# EAGLE board pdp8l (EAGLE 6.6.0), part 1 of 10
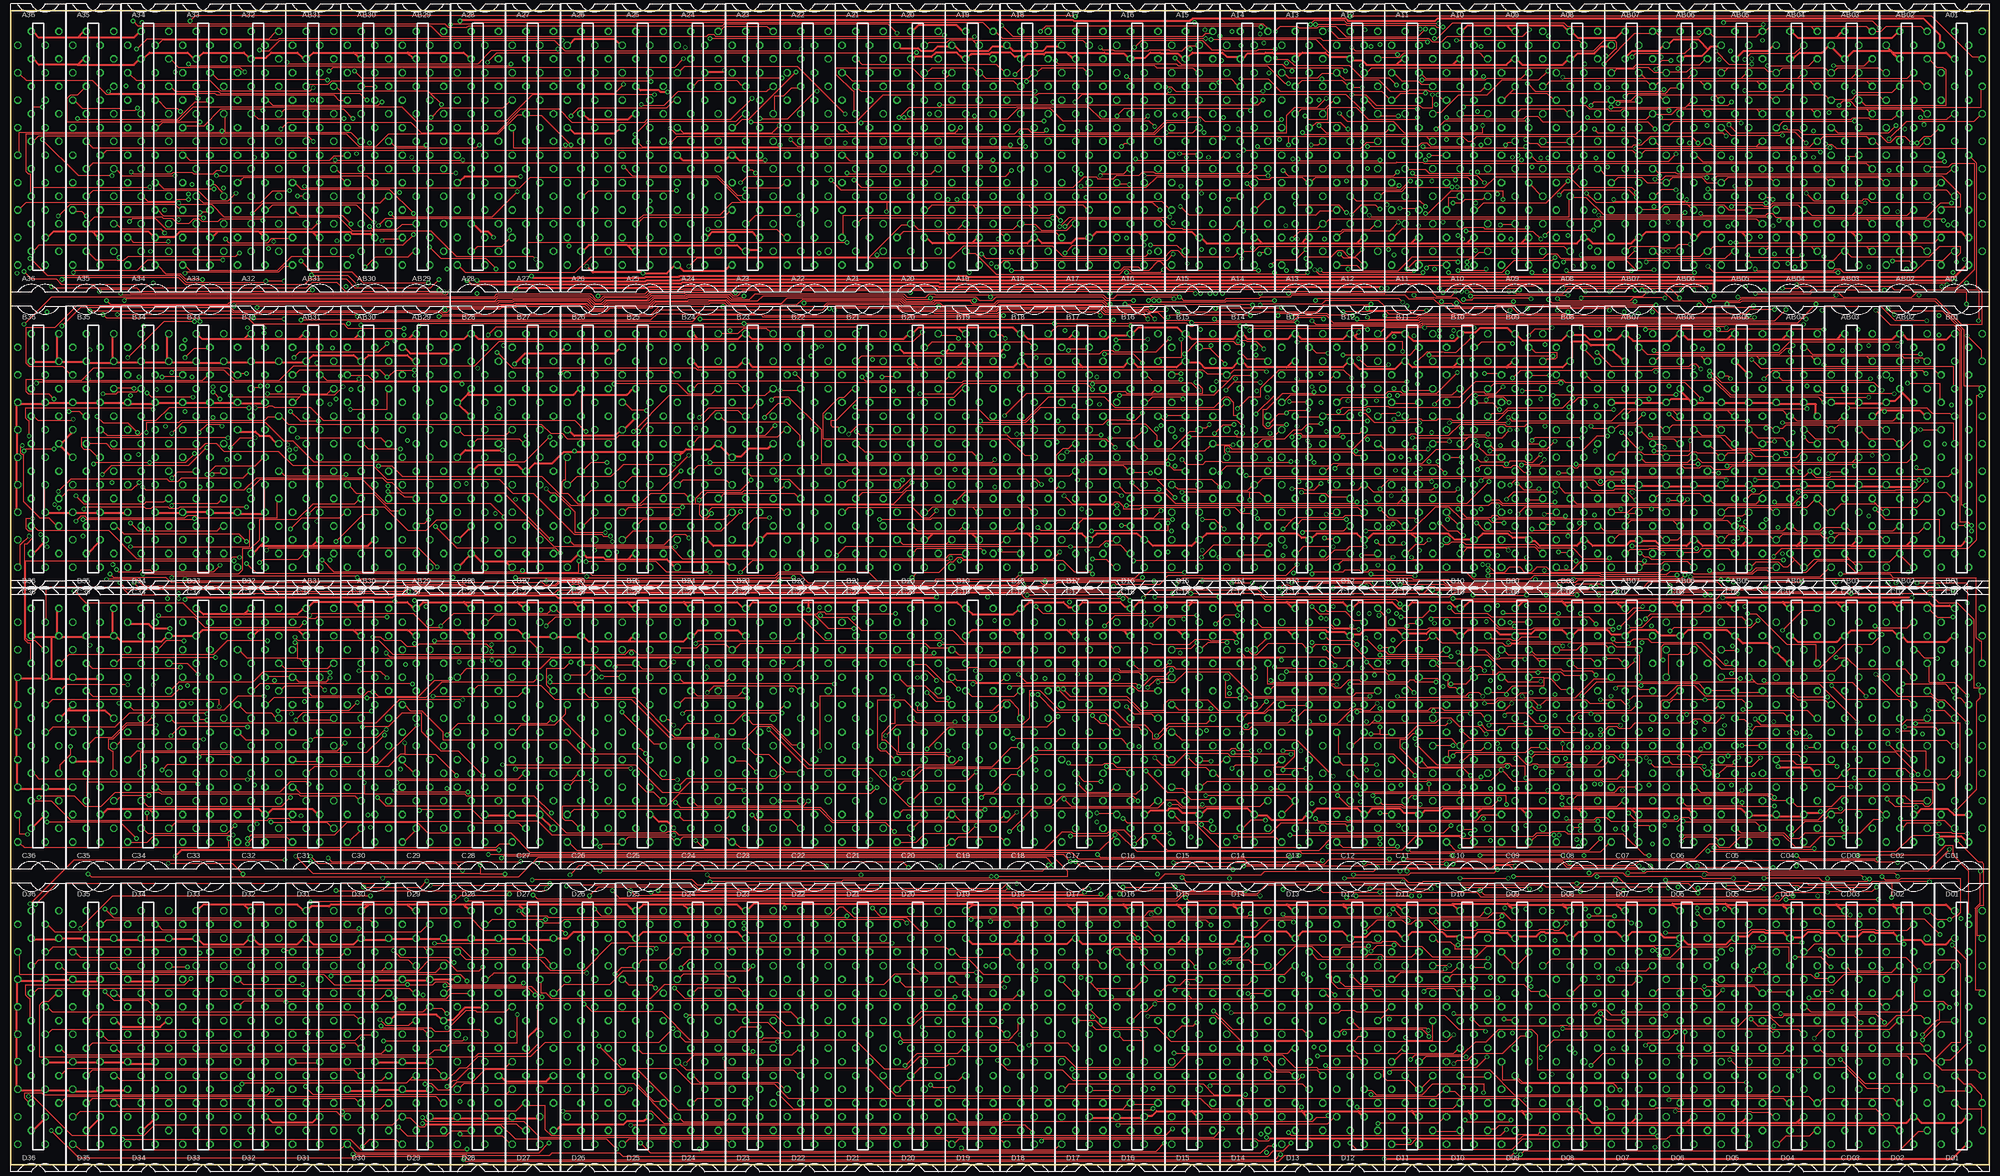
[diagram p23: board, top side]
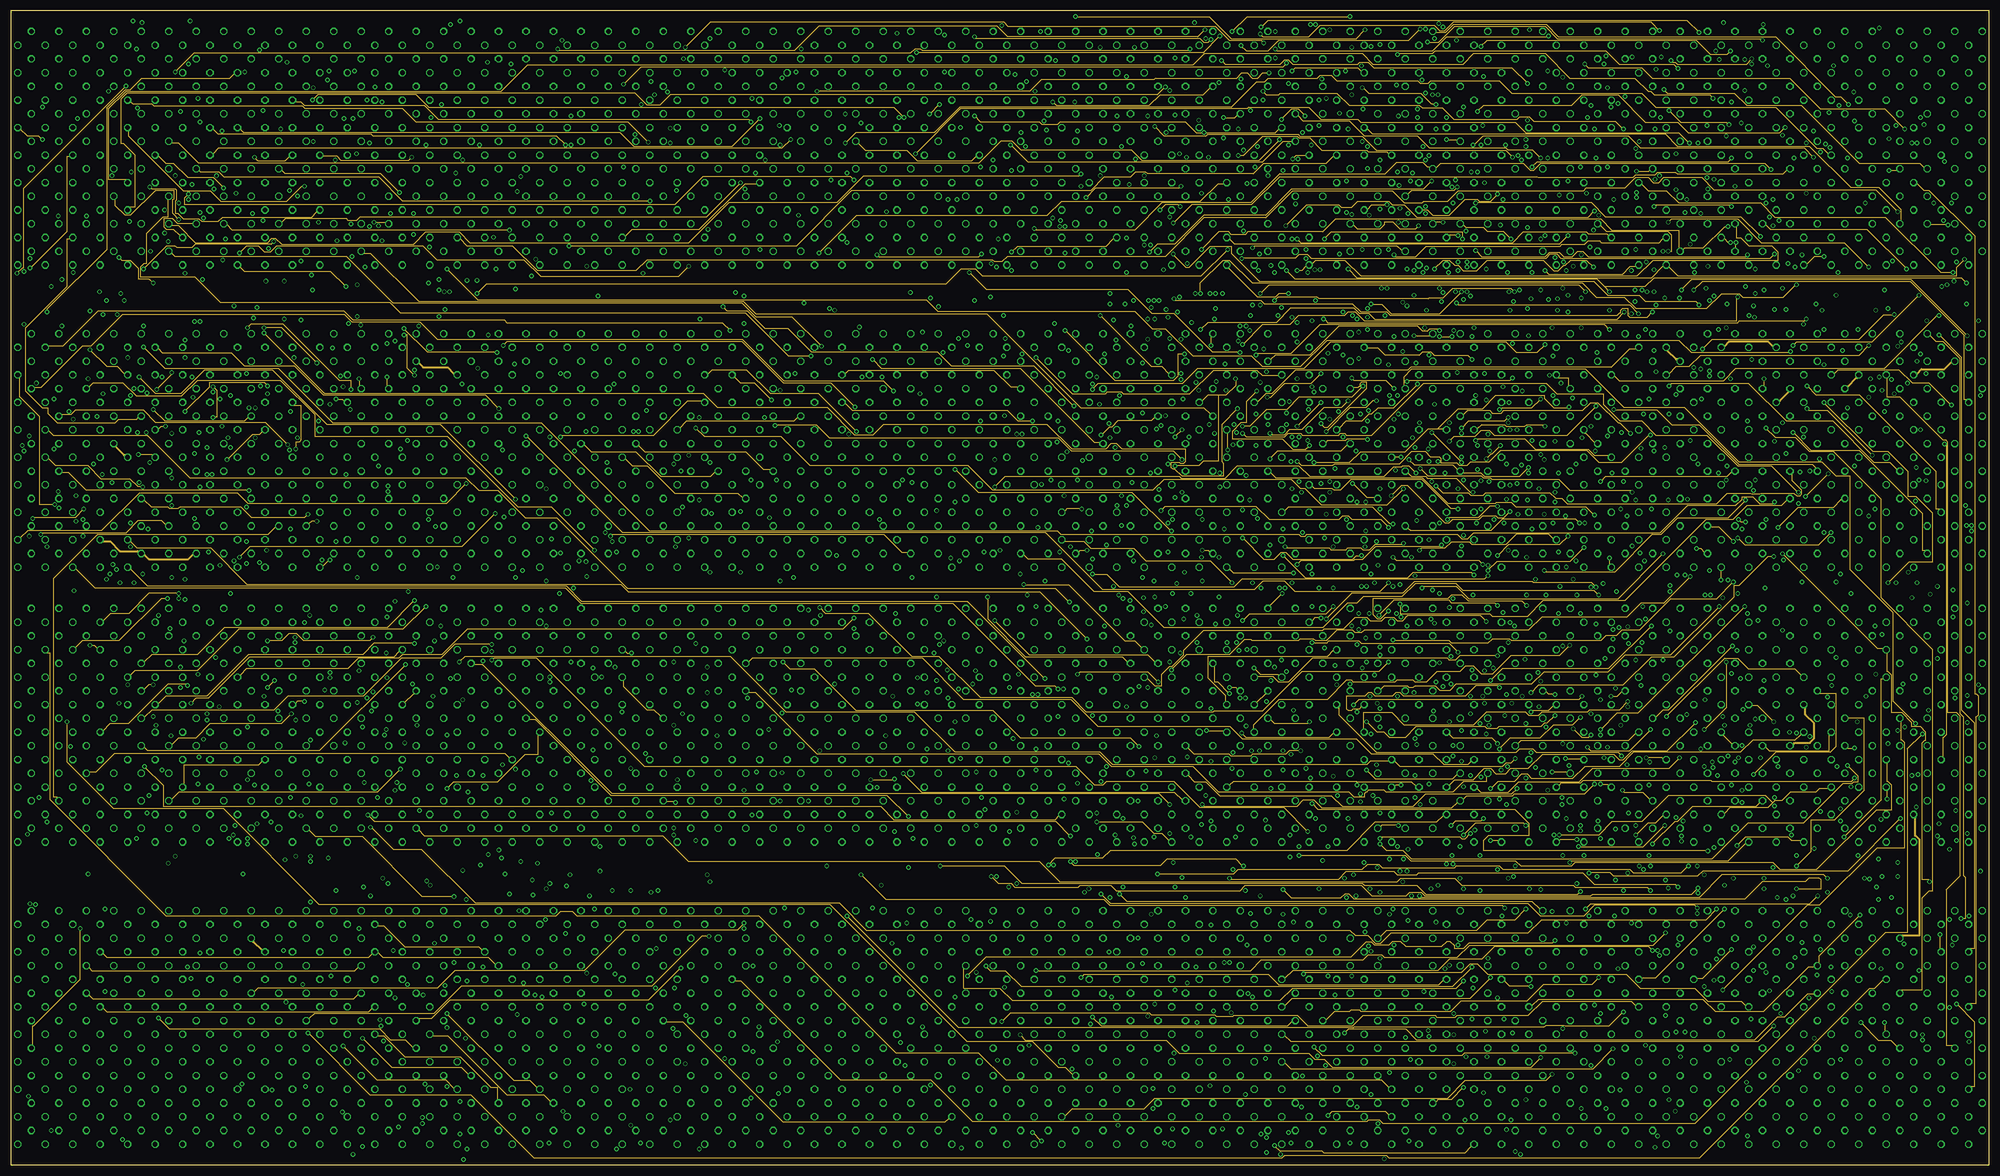
[diagram p24: board, inner layer Route2]
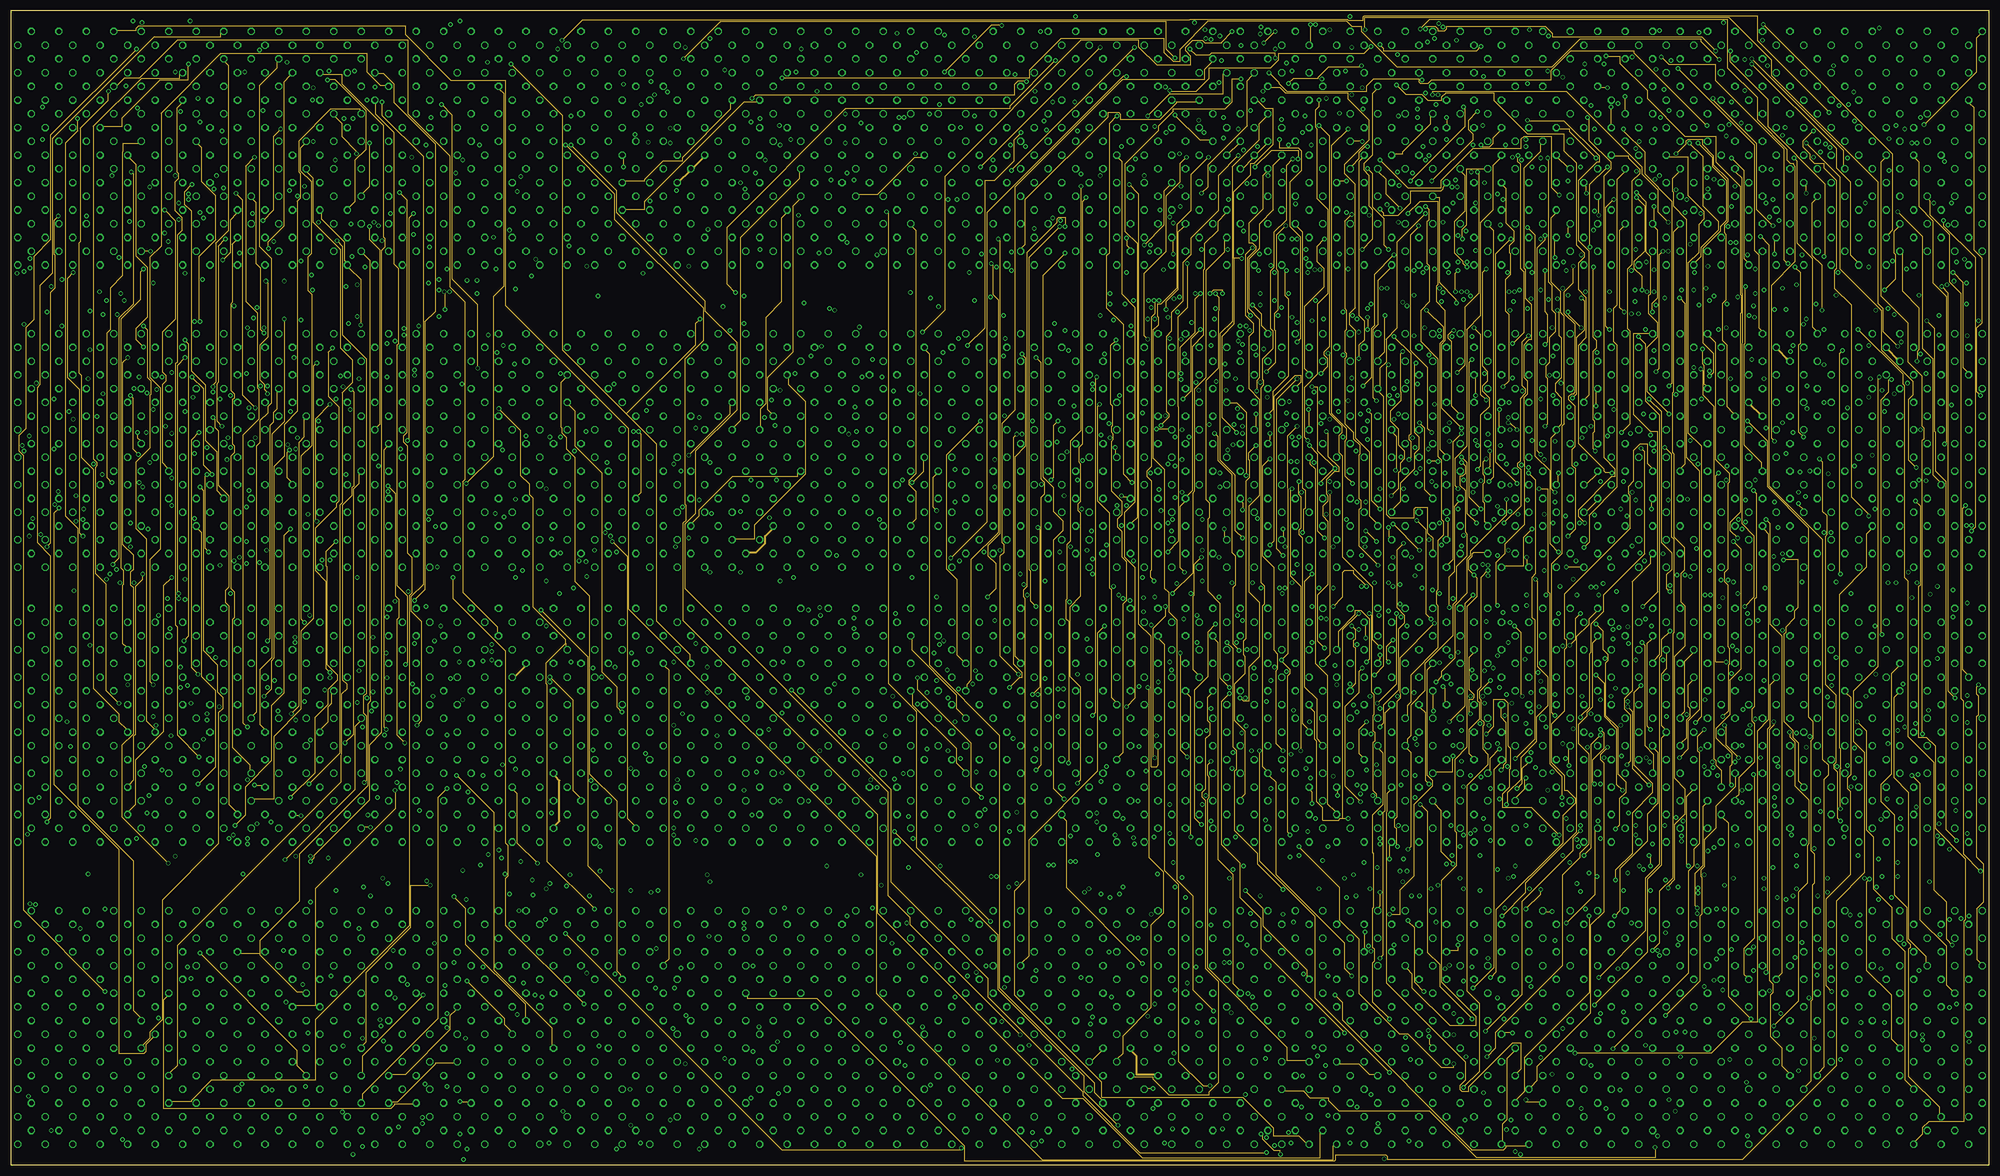
[diagram p25: board, inner layer Route15]
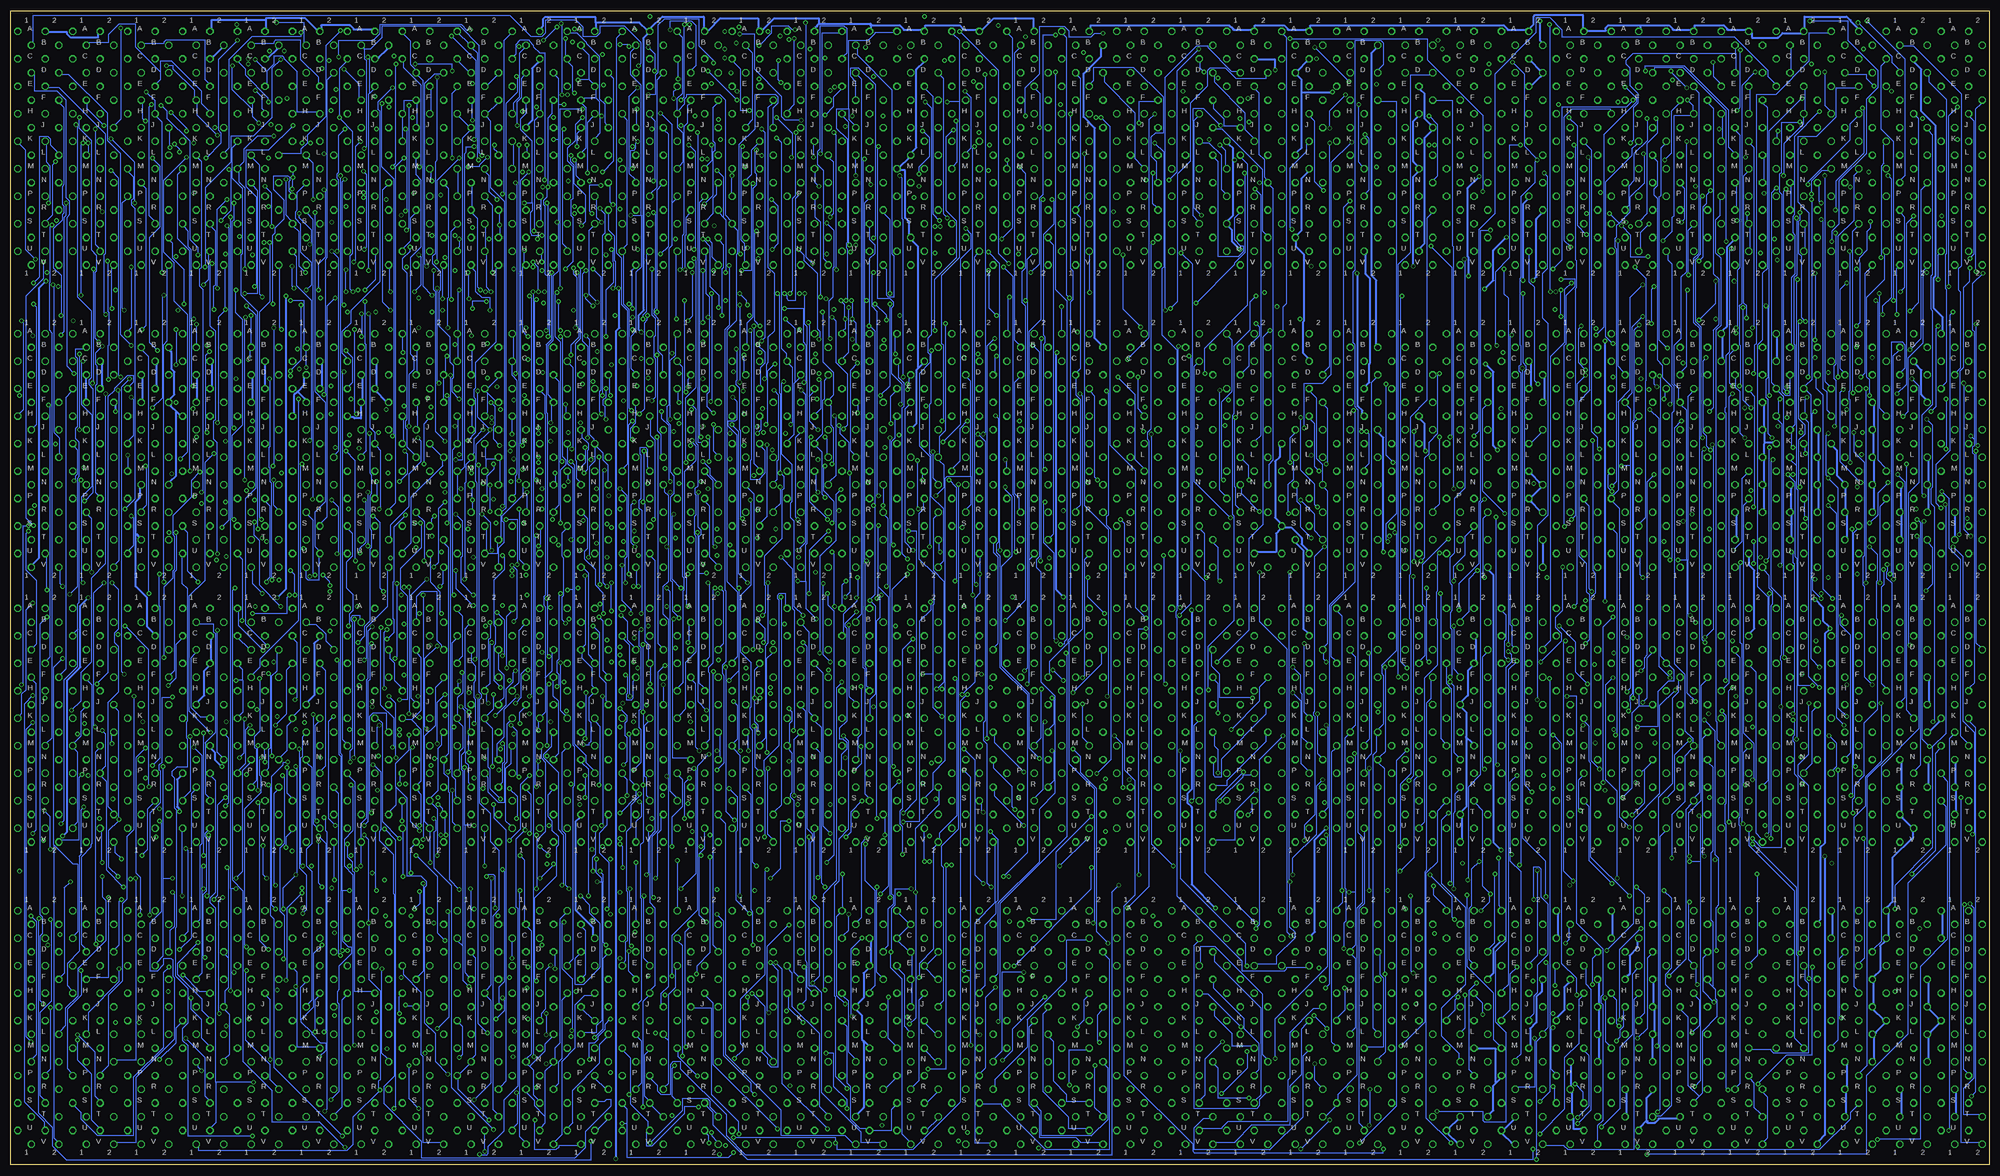
[diagram p26: board, bottom side, seen from below]

Size 457.2 x 266.7 mm. Coordinates in mm from the lower left corner, seen from the top.
Outline: 0,0 457.2,0 457.2,266.7 0,266.7 0,0
Copper layers (1*2*15*16): Top 0.035mm / dielectric 1.5mm / Route2 0.035mm / dielectric 0.15mm / Route15 0.035mm / dielectric 0.2mm / Bottom 0.035mm
Design rules "8mils": minimum track width 8mil, minimum drill 24mil, track to track 8mil, track to pad 8mil, pad to pad 8mil, via to via 8mil, smd to smd 8mil, copper to edge 25mil, drill to drill 8mil, minimum pad ring 10mil, minimum via ring 8mil, stop-mask expansion 0mil, vias tented up to drill 0mil, thermal gap 10mil
Net classes: 1 Supply: width 0.508 mm

## Footprints (pad centres in the part's own frame; a part is rotated, then mirrored left to right if it is on the bottom)
H807 = drill 1.092 octagon: A1 4.763,28.575; A2 -1.587,28.575; B1 1.587,25.4; B2 -4.763,25.4; C1 4.763,22.225; C2 -1.587,22.225; D1 1.587,19.05; D2 -4.763,19.05; E1 4.763,15.875; E2 -1.587,15.875; F1 1.587,12.7; F2 -4.763,12.7; H1 4.763,9.525; H2 -1.587,9.525; J1 1.587,6.35; J2 -4.763,6.35; K1 4.763,3.175; K2 -1.587,3.175; L1 1.587,0; L2 -4.763,0; M1 4.763,-3.175; M2 -1.587,-3.175; N1 1.587,-6.35; N2 -4.763,-6.35; P1 4.763,-9.525; P2 -1.587,-9.525; R1 1.587,-12.7; R2 -4.763,-12.7; S1 4.763,-15.875; S2 -1.587,-15.875; T1 1.587,-19.05; T2 -4.763,-19.05; U1 4.763,-22.225; U2 -1.587,-22.225; V1 1.587,-25.4; V2 -4.763,-25.4
H807-2 = drill 1.092 octagon: AA1 4.763,60.325; AA2 -1.587,60.325; AB1 1.587,57.15; AB2 -4.763,57.15; AC1 4.763,53.975; AC2 -1.587,53.975; AD1 1.587,50.8; AD2 -4.763,50.8; AE1 4.763,47.625; AE2 -1.587,47.625; AF1 1.587,44.45; AF2 -4.763,44.45; AH1 4.763,41.275; AH2 -1.587,41.275; AJ1 1.587,38.1; AJ2 -4.763,38.1; AK1 4.763,34.925; AK2 -1.587,34.925; AL1 1.587,31.75; AL2 -4.763,31.75; AM1 4.763,28.575; AM2 -1.587,28.575; AN1 1.587,25.4; AN2 -4.763,25.4; AP1 4.763,22.225; AP2 -1.587,22.225; AR1 1.587,19.05; AR2 -4.763,19.05; AS1 4.763,15.875; AS2 -1.587,15.875; AT1 1.587,12.7; AT2 -4.763,12.7; AU1 4.763,9.525; AU2 -1.587,9.525; AV1 1.587,6.35; AV2 -4.763,6.35; BA1 4.763,-9.525; BA2 -1.587,-9.525; BB1 1.587,-12.7; BB2 -4.763,-12.7; BC1 4.763,-15.875; BC2 -1.587,-15.875; BD1 1.587,-19.05; BD2 -4.763,-19.05; BE1 4.763,-22.225; BE2 -1.587,-22.225; BF1 1.587,-25.4; BF2 -4.763,-25.4; BH1 4.763,-28.575; BH2 -1.587,-28.575; BJ1 1.587,-31.75; BJ2 -4.763,-31.75; BK1 4.763,-34.925; BK2 -1.587,-34.925; BL1 1.587,-38.1; BL2 -4.763,-38.1; BM1 4.763,-41.275; BM2 -1.587,-41.275; BN1 1.587,-44.45; BN2 -4.763,-44.45; BP1 4.763,-47.625; BP2 -1.587,-47.625; BR1 1.587,-50.8; BR2 -4.763,-50.8; BS1 4.763,-53.975; BS2 -1.587,-53.975; BT1 1.587,-57.15; BT2 -4.763,-57.15; BU1 4.763,-60.325; BU2 -1.587,-60.325; BV1 1.587,-63.5; BV2 -4.763,-63.5

## Placement (x,y rotation side)
A01  G921  [H807]  450.85,233.36 0 top
A08  M617  [H807]  361.95,233.36 0 top
A09  M617  [H807]  349.25,233.36 0 top
A10  M160  [H807]  336.55,233.36 0 top
A11  M115  [H807]  323.85,233.36 0 top
A12  M160  [H807]  311.15,233.36 0 top
A13  M160  [H807]  298.45,233.36 0 top
A14  M115  [H807]  285.75,233.36 0 top
A15  M162  [H807]  273.05,233.36 0 top
A16  M162  [H807]  260.35,233.36 0 top
A17  G020  [H807]  247.65,233.36 0 top
A18  G020  [H807]  234.95,233.36 0 top
A19  G020  [H807]  222.25,233.36 0 top
A20  G020  [H807]  209.55,233.36 0 top
A21  W025A  [H807]  196.85,233.36 0 top
A22  W025A  [H807]  184.15,233.36 0 top
A23  G228  [H807]  171.45,233.36 0 top
A24  G228  [H807]  158.75,233.36 0 top
A25  G624  [H807]  146.05,233.36 0 top
A26  G624  [H807]  133.35,233.36 0 top
A27  G826A  [H807]  120.65,233.36 0 top
A28  G785A  [H807]  107.95,233.36 0 top
A32  M516  [H807]  57.15,233.36 0 top
A33  M516  [H807]  44.45,233.36 0 top
A34  M111  [H807]  31.75,233.36 0 top
A35  M111  [H807]  19.05,233.36 0 top
A36  M703  [H807]  6.35,233.36 0 top
AB02  M220  [H807-2]  438.15,201.61 0 top
AB03  M220  [H807-2]  425.45,201.61 0 top
AB04  M220  [H807-2]  412.75,201.61 0 top
AB05  M220  [H807-2]  400.05,201.61 0 top
AB06  M220  [H807-2]  387.35,201.61 0 top
AB07  M220  [H807-2]  374.65,201.61 0 top
AB29  M715  [H807-2]  95.25,201.61 0 top
AB30  M705  [H807-2]  82.55,201.61 0 top
AB31  M710  [H807-2]  69.85,201.61 0 top
B01  G921  [H807]  450.85,163.51 0 top
B08  M617  [H807]  361.95,163.51 0 top
B09  M617  [H807]  349.25,163.51 0 top
B10  M160  [H807]  336.55,163.51 0 top
B11  M216  [H807]  323.85,163.51 0 top
B12  M111  [H807]  311.15,163.51 0 top
B13  M113  [H807]  298.45,163.51 0 top
B14  M119  [H807]  285.75,163.51 0 top
B15  M119  [H807]  273.05,163.51 0 top
B16  M162  [H807]  260.35,163.51 0 top
B17  M162  [H807]  247.65,163.51 0 top
B18  G020  [H807]  234.95,163.51 0 top
B19  G020  [H807]  222.25,163.51 0 top
B20  G020  [H807]  209.55,163.51 0 top
B21  W025B  [H807]  196.85,163.51 0 top
B22  W025B  [H807]  184.15,163.51 0 top
B23  G228  [H807]  171.45,163.51 0 top
B24  G228  [H807]  158.75,163.51 0 top
B25  G624  [H807]  146.05,163.51 0 top
B26  G624  [H807]  133.35,163.51 0 top
B27  G826B  [H807]  120.65,163.51 0 top
B28  G785B  [H807]  107.95,163.51 0 top
B32  M906  [H807]  57.15,163.51 0 top
B33  M906  [H807]  44.45,163.51 0 top
B34  M903  [H807]  31.75,163.51 0 top
B35  M903  [H807]  19.05,163.51 0 top
B36  M903  [H807]  6.35,163.51 0 top
C01  G921  [H807]  450.85,100.01 0 top
C02  M113  [H807]  438.15,100.01 0 top
C04  M216  [H807]  412.75,100.01 0 top
C05  M113  [H807]  400.05,100.01 0 top
C06  M216  [H807]  387.35,100.01 0 top
C07  M111  [H807]  374.65,100.01 0 top
C08  M216  [H807]  361.95,100.01 0 top
C09  M115  [H807]  349.25,100.01 0 top
C10  M119  [H807]  336.55,100.01 0 top
C11  M117  [H807]  323.85,100.01 0 top
C12  M115  [H807]  311.15,100.01 0 top
C13  M117  [H807]  298.45,100.01 0 top
C14  M113  [H807]  285.75,100.01 0 top
C15  M113  [H807]  273.05,100.01 0 top
C16  M111  [H807]  260.35,100.01 0 top
C17  M360  [H807]  247.65,100.01 0 top
C18  G221  [H807]  234.95,100.01 0 top
C19  G221  [H807]  222.25,100.01 0 top
C20  G610A  [H807]  209.55,100.01 0 top
C21  H807  [H807]  196.85,100.01 0 top
C22  G610A  [H807]  184.15,100.01 0 top
C23  G221  [H807]  171.45,100.01 0 top
C24  G221  [H807]  158.75,100.01 0 top
C25  G228  [H807]  146.05,100.01 0 top
C26  M002  [H807]  133.35,100.01 0 top
C27  M623  [H807]  120.65,100.01 0 top
C28  M115  [H807]  107.95,100.01 0 top
C29  M660  [H807]  95.25,100.01 0 top
C30  M660  [H807]  82.55,100.01 0 top
C31  M707A  [H807]  69.85,100.01 0 top
C32  M706A  [H807]  57.15,100.01 0 top
C33  M452  [H807]  44.45,100.01 0 top
C34  M916  [H807]  31.75,100.01 0 top
C35  M903  [H807]  19.05,100.01 0 top
C36  M903  [H807]  6.35,100.01 0 top
CD03  M700  [H807-2]  425.45,68.26 0 top
D01  G921  [H807]  450.85,30.16 0 top
D02  M111  [H807]  438.15,30.16 0 top
D04  M115  [H807]  412.75,30.16 0 top
D05  M310  [H807]  400.05,30.16 0 top
D06  M310  [H807]  387.35,30.16 0 top
D07  M310  [H807]  374.65,30.16 0 top
D08  M310  [H807]  361.95,30.16 0 top
D09  M160  [H807]  349.25,30.16 0 top
D10  M216  [H807]  336.55,30.16 0 top
D11  M113  [H807]  323.85,30.16 0 top
D12  M113  [H807]  311.15,30.16 0 top
D13  M111  [H807]  298.45,30.16 0 top
D14  M310  [H807]  285.75,30.16 0 top
D15  M310  [H807]  273.05,30.16 0 top
D16  M216  [H807]  260.35,30.16 0 top
D17  M617  [H807]  247.65,30.16 0 top
D18  G221  [H807]  234.95,30.16 0 top
D19  G221  [H807]  222.25,30.16 0 top
D20  G611B  [H807]  209.55,30.16 0 top
D21  H807  [H807]  196.85,30.16 0 top
D22  G611B  [H807]  184.15,30.16 0 top
D23  G221  [H807]  171.45,30.16 0 top
D24  G221  [H807]  158.75,30.16 0 top
D25  G228  [H807]  146.05,30.16 0 top
D26  H807  [H807]  133.35,30.16 0 top
D27  M623  [H807]  120.65,30.16 0 top
D28  M623  [H807]  107.95,30.16 0 top
D29  M906  [H807]  95.25,30.16 0 top
D30  M906  [H807]  82.55,30.16 0 top
D31  M707B  [H807]  69.85,30.16 0 top
D32  M706B  [H807]  57.15,30.16 0 top
D33  W076  [H807]  44.45,30.16 0 top
D34  M903  [H807]  31.75,30.16 0 top
D35  M903  [H807]  19.05,30.16 0 top
D36  M903  [H807]  6.35,30.16 0 top
U$1  [CBLOCK]  0,0 0 top
U$2  [CBLOCK]  50.8,0 0 top
U$3  [CBLOCK]  101.6,0 0 top
U$4  [CBLOCK]  152.4,0 0 top
U$5  [CBLOCK]  203.2,0 0 top
U$6  [CBLOCK]  254,0 0 top
U$7  [CBLOCK]  304.8,0 0 top
U$8  [CBLOCK]  355.6,0 0 top
U$9  [CBLOCK]  406.4,0 0 top
U$10  [CBLOCK]  0,133.35 0 top
U$11  [CBLOCK]  50.8,133.35 0 top
U$12  [CBLOCK]  101.6,133.35 0 top
U$13  [CBLOCK]  152.4,133.35 0 top
U$14  [CBLOCK]  203.2,133.35 0 top
U$15  [CBLOCK]  254,133.35 0 top
U$16  [CBLOCK]  304.8,133.35 0 top
U$17  [CBLOCK]  355.6,133.35 0 top
U$18  [CBLOCK]  406.4,133.35 0 top

## Tracks (layer width: path | path; a pad name or v marks a point on that pad's centre or on a via)
3CYCLE  (via drill 0.61)
  Top 0.203: v201.17,64.62 158.7,64.62 157.48,65.84 v120.5,65.84
  Route2 0.203: v116.64,153.82 99.36,171.09 73.15,171.09 60.55,183.69 44.7,183.69 39.22,178.21 33.53,178.21 v29.67,182.07
  Bottom 0.203: v201.17,64.62 202.79,62.99 202.79,2.23 287.32,2.23 291.8,6.71 291.8,11.58 302.36,22.15 302.36,23.77 304.19,23.77 304.8,23.16 304.8,16.26 306.83,16.26 307.64,17.07 307.64,18.29 309.27,19.91 D12.P2 | v120.5,65.84 120.29,66.04 120.29,87.38 117.45,90.22 117.45,153.01 v116.64,153.82 | v29.67,182.07 28.65,183.08 28.65,206.04 27.43,207.26 A34.V2
!3CYCLE  (via drill 0.61)
  Top 0.203: v19.1,161.95 19.51,162.36 v32.11,162.36 40.44,162.36 v42.47,164.39
  Route15 0.203: v32.31,211.12 30.89,211.12 A34.U2
  Bottom 0.203: v19.1,161.95 19.1,105.05 17.88,103.83 C35.K2 | v42.47,164.39 42.47,166.01 B33.K2 | v32.31,211.12 32.11,210.92 32.11,179.02 32.31,178.82 32.31,176.99 32.11,176.78 v32.11,162.36
!!AC_ENABLE  (via drill 0.61)
  Top 0.203: v298.5,238.56 298.91,238.15 361.7,238.15 362.92,239.37 A08.J1
  Bottom 0.203: A08.K1 366.78,237.34 366.78,242.21 A08.H1 366.37,243.64 366.37,245.87 364.34,245.87 A08.F1 363.32,245.26 363.32,240.39 A08.J1 | v298.5,238.56 298.5,167.03 297.49,167.03 B13.K2
!!L_ENABLE  (via drill 0.61)
  Route2 0.203: v313.54,167.64 313.33,167.84 308.86,167.84 308.46,167.44 304.39,167.44 303.99,167.03 B13.K1
  Bottom 0.203: v313.54,167.64 313.94,168.05 313.94,170.28 312.73,171.5 312.73,175.56 B12.F1
!(IOT+OPR)  (via drill 0.61)
  Top 0.203: v337.92,40.84 337.51,41.25 308.25,41.25 307.04,42.47 D12.F2 | v340.16,108.31 339.34,109.12 336.91,109.12 336.09,108.31 330.2,108.31 330.2,111.96 329.79,112.37 326.14,112.37 C11.F1
  Route15 0.203: v337.92,40.84 342.8,45.72 342.8,91.44 344.22,92.86 C09.N2
  Bottom 0.203: v340.16,108.31 343.2,105.26 343.2,98.96 344.83,97.33 344.83,94.28 C09.N2
!A  (via drill 0.61)
  Top 0.203: v30.48,136.55 52.63,136.55 53.65,137.57 53.65,142.44 55.47,142.44 57.51,144.47 57.51,149.15 66.24,149.15 69.9,152.81 79.45,152.81 80.26,153.62 AB30.BP2
  Route15 0.203: v30.48,136.55 30.48,135.33 28.85,133.71 28.85,99.57 28.45,99.16 28.45,89 27.43,87.99 C34.R2
!AC00  (via drill 0.61)
  Top 0.203: v440.54,236.12 442.16,237.74 443.79,237.74 445.41,239.37 A01.J2 | v411.89,189.38 411.28,188.77 410.26,188.77 408.84,187.35 378.15,187.35 376.94,188.57 AB07.BB1
  Route2 0.203: B14.F1 288.14,176.38 289.97,178.21 291.39,178.21 296.88,183.69 322.88,183.69 323.49,184.3 369.82,184.3 374.09,188.57 375.51,188.57 AB07.BB1 | v440.94,200.97 430.17,190.19 412.7,190.19 v411.89,189.38
  Bottom 0.203: v440.54,236.12 440.94,235.71 v440.94,200.97
!AC01  (via drill 0.61)
  Route2 0.203: v294.84,206.65 296.88,204.62 366.57,204.62 368.2,203 | 368.2,203 v369.42,201.78 | v451.92,203.81 450.7,205.03 379.78,205.03 377.75,203 368.2,203
  Route15 0.203: v294.84,206.65 294.44,206.25 294.44,200.97 295.25,200.15 295.25,182.27 291.59,178.61 291.59,174.55 290.78,173.74 B14.H1
  Bottom 0.203: v369.42,201.78 369.62,201.98 369.62,207.26 AB07.AV2 | v451.92,203.81 450.49,205.23 450.49,237.74 448.67,237.74 448.06,237.13 448.06,235.71 446.43,234.09 A01.L2
!AC02  (via drill 0.61)
  Top 0.203: v287.73,173.53 292.2,178 292.2,180.85 322.48,180.85 v322.68,181.05 | v347.07,181.86 348.89,183.69 379.37,183.69 379.78,184.1 388.72,184.1 v388.93,184.3 | A01.L1 454.36,231.44 454.36,202.59 454.96,202.59 455.57,201.98 455.57,194.26 450.7,194.26 444.81,200.15 399.9,200.15 399.49,199.75 v392.58,199.75
  Route2 0.203: v322.68,181.05 322.88,181.25 346.46,181.25 v347.07,181.86
  Route15 0.203: v287.73,173.53 287.73,170.49 B14.J1
  Bottom 0.203: v388.93,184.3 388.93,188.16 AB06.BB1 389.33,189.59 389.33,199.75 v392.58,199.75
!AC03  (via drill 0.61)
  Route2 0.203: v290.98,169.06 291.39,168.66 294.23,168.66 295.45,169.88 298.3,169.88 303.38,174.96 307.44,174.96 v309.07,176.58 | v309.07,207.06 311.1,205.03 379.17,205.03 381.81,207.67 AB06.AV2 383.24,207.47 385.27,205.44 449.68,205.44 449.68,207.47 v451.51,209.3
  Route15 0.203: v290.98,169.06 290.98,167.64 290.78,167.44 B14.K1
  Bottom 0.203: v309.07,176.58 308.25,177.39 308.25,186.33 308.66,186.74 308.66,191.21 308.25,191.62 308.25,195.68 309.07,196.49 v309.07,207.06 | v451.51,209.3 453.75,211.53 453.75,234.49 455.17,235.91 A01.K1
!AC04  (via drill 0.61)
  Top 0.203: v286.31,192.84 286.71,193.24 313.33,193.24 v313.54,193.04 | v313.54,195.88 313.94,195.48 325.12,195.48 325.53,195.88 401.32,195.88 v401.73,196.29 | v402.34,186.13 404.37,184.1 444.19,184.1 445.41,182.88 B01.D2
  Route15 0.203: v313.54,195.88 v313.54,193.04
  Bottom 0.203: v286.31,192.84 286.11,192.63 286.11,162.97 286.31,162.76 286.31,158.5 284.28,158.5 282.85,159.92 282.85,165 283.87,166.01 B14.K2 | v401.73,196.29 401.73,189.59 AB05.BB1 401.93,188.16 401.93,186.54 v402.34,186.13
!AC05  (via drill 0.61)
  Top 0.203: v377.34,173.53 375.31,171.5 350.72,171.5 349.91,170.69 345.64,170.69 345.24,171.09 334.87,171.09 332.23,168.45 325.12,168.45 324.71,168.86 323.49,168.86 323.29,168.66 313.33,168.66 310.08,165.41 282.25,165.41 281.63,166.01 280.42,166.01 280.42,164.79 280.62,164.59 280.62,164.19 B14.L2 | v377.75,193.04 377.95,193.24 394.41,193.24 v394.61,193.04 394.82,192.63 396.85,192.63 397.46,193.24 418.8,193.24 v419,193.04 | v419,184.91 419.4,184.51 448.87,184.51 448.87,180.03 B01.E2
  Bottom 0.203: v377.34,173.53 377.75,173.94 v377.75,193.04 | v394.61,193.04 395.02,193.45 395.02,207.26 AB05.AV2 | v419,193.04 v419,184.91
!AC06  (via drill 0.61)
  Top 0.203: v285.5,193.85 325.93,193.85 326.34,194.26 v414.32,194.26 | v441.35,169.88 445.41,169.88 B01.J2 | v441.35,187.35 416.36,187.35 415.14,188.57 AB04.BB1
  Bottom 0.203: v285.5,193.85 285.5,162.15 284.48,161.14 B14.M2 | v414.32,194.26 414.32,189.59 AB04.BB1 | v441.35,187.35 v441.35,169.88
!AC07  (via drill 0.61)
  Top 0.203: v280.82,179.02 282.65,180.85 v288.75,180.85 | v288.75,198.73 288.95,198.93 302.97,198.93 303.78,199.75 316.18,199.75 317.4,198.53 v322.68,198.53 | v324.31,200.97 324.71,200.56 328.98,200.56 329.18,200.35 334.06,200.35 335.28,199.14 346.86,199.14 v347.27,199.54 | v350.52,197.92 350.93,198.32 379.37,198.32 381,196.7 400.91,196.7 401.93,197.71 v407.62,197.71 | v409.45,171.5 448.87,171.5 448.87,167.44 B01.K2
  Bottom 0.203: v280.82,179.02 279.81,178 279.81,162.97 280.21,162.56 280.21,158.29 280.62,157.89 B14.N2 | v288.75,198.73 v288.75,180.85 | v322.68,198.53 324.31,200.15 v324.31,200.97 | v347.27,199.54 350.52,199.54 v350.52,197.92 | AB04.AV2 407.62,207.26 v407.62,197.71 407.82,197.31 409.25,195.88 409.25,171.7 v409.45,171.5
!AC08  (via drill 0.61)
  Top 0.203: v300.74,136.55 301.14,136.96 307.85,136.96 308.25,137.36 311.71,137.36 312.12,136.96 313.54,136.96 313.94,137.36 318.01,137.36 318.41,136.96 336.3,136.96 337.92,135.33 351.13,135.33 351.94,136.14 367.18,136.14 367.39,135.94 384.66,135.94 v385.06,136.35 | v383.44,133.91 384.45,132.89 403.96,132.89 404.77,132.08 v425.3,132.08 442.57,132.08 443.38,132.89 v448.87,132.89
  Route15 0.203: v300.74,136.55 298.91,134.72 298.91,110.54 301.75,107.7 301.75,98.55 302.77,97.54 C13.M1
  Bottom 0.203: v385.06,136.35 383.44,134.72 v383.44,133.91 | v448.87,132.89 448.87,140.61 B01.U2 | v425.3,132.08 425.3,186.74 426.72,188.16 AB03.BB1
!AC09  (via drill 0.61)
  Top 0.203: v366.37,133.5 377.34,133.5 378.56,134.72 394.41,134.72 395.83,133.3 404.17,133.3 404.98,132.49 421.84,132.49 | 421.84,132.49 424.49,132.49 425.7,133.71 v445.21,133.71 | 421.84,132.49 v421.84,134.72
  Route2 0.203: v303.99,126.19 309.88,132.08 321.67,132.08 324.31,134.72 351.74,134.72 351.94,134.52 365.35,134.52 v366.37,133.5
  Bottom 0.203: v303.99,126.19 304.39,125.78 304.39,94.08 300.74,94.08 C13.N1 | v445.21,133.71 445.82,134.31 445.82,137.36 B01.V2 | v421.84,134.72 421.84,189.59 421.03,190.4 421.03,207.26 AB03.AV2
!AC10  (via drill 0.61)
  Top 0.203: v304.39,73.56 305.21,72.75 321.46,72.75 324.51,75.79 334.87,75.79 335.28,75.39 337.11,75.39 337.51,75.79 351.74,75.79 352.55,76.61 355.8,76.61 356.21,77.01 359.26,77.01 359.87,76.4 372.67,76.4 377.55,71.53 v378.56,71.53 | v378.97,69.09 379.78,68.28 406.4,68.28 406.81,67.87 442.98,67.87 v448.06,72.95 | v449.48,81.89 454.36,86.77 454.36,107.09 455.17,107.9 455.17,108.92 C01.H1 455.17,110.13 453.75,110.13 453.75,125.98 449.88,129.84 445.62,129.84 v443.59,131.88
  Route15 0.203: v378.56,71.53 378.97,71.12 v378.97,69.09
  Bottom 0.203: v304.39,73.56 304.39,80.47 301.95,82.91 301.95,89 302.77,89.81 C13.P1 | v448.06,72.95 448.06,80.47 v449.48,81.89 | v443.59,131.88 441.76,133.71 441.76,158.7 441.35,159.11 441.35,167.03 442.16,167.84 442.16,170.28 441.76,170.69 441.76,186.33 442.16,186.74 442.16,188.57 440.54,188.57 AB02.BB1
!AC11  (via drill 0.61)
  Top 0.203: v392.18,72.54 392.38,72.34 435.66,72.34 439.52,76.2 444.19,76.2 444.81,76.81 448.46,76.81 448.67,76.61 v452.12,76.61 | v433.83,197.92 434.44,197.31 446.43,197.31 450.9,192.84 450.9,152.4 v451.71,152.4
  Route2 0.203: v300.74,83.52 302.16,82.09 347.68,82.09 350.93,78.84 350.93,76.2 341.58,76.2 340.36,74.98 340.36,72.54 v392.18,72.54
  Route15 0.203: v300.74,83.52 300.74,86.16 300.33,86.56 C13.R1 | v451.71,152.4 451.1,151.79 451.1,114.4 452.12,113.39 C01.F1
  Bottom 0.203: v452.12,76.61 451.31,77.42 451.31,111.15 452.12,111.96 C01.F1 | v433.83,197.92 433.83,207.26 AB02.AV2
!AC_CLEAR  (via drill 0.61)
  Top 0.203: v343.61,38.61 343.41,38.41 305,38.41 303.99,39.42 D13.H1 | v345.03,33.73 345.24,33.53 346.86,33.53 D09.K2
  Bottom 0.203: v343.61,38.61 343.2,38.2 343.2,35.56 v345.03,33.73
!AC_ENABLE  (via drill 0.61)
  Top 0.203: AB02.BJ2 432.61,170.08 431.6,171.09 422.45,171.09 421.44,170.08 AB03.BJ2 420.01,170.28 419.2,171.09 410.26,171.09 409.45,170.28 408.63,170.28 AB04.BJ2 407.21,170.08 406.2,171.09 393.8,171.09 | 393.8,171.09 394.61,170.28 AB05.BJ2 | 393.8,171.09 384.05,171.09 383.24,170.28 AB06.BJ2 381.81,170.08 380.8,171.09 371.65,171.09 370.64,170.08 AB07.BJ2 369.21,170.28 365.56,170.28 v365.15,170.69
  Bottom 0.203: v365.15,170.69 365.15,182.68 363.93,183.9 363.93,186.54 364.74,187.35 364.74,209.7 362.31,212.14 362.31,227.58 363.52,228.8 363.52,232.66 A08.L1
!ADD  (via drill 0.61)
  Top 0.203: A08.K2 359.66,236.32 354.79,236.32 A09.K1
  Route2 0.203: v316.18,127 319.63,130.45 332.44,130.45 333.05,129.84 343,129.84 v343.61,129.24
  Route15 0.203: v343.61,129.24 343.2,129.64 343.2,139.19 345.24,141.22 345.24,143.46 349.71,147.93 349.71,161.14 349.91,161.34 349.91,162.56 349.71,162.76 349.71,177.39 350.52,178.21 350.52,181.05 349.71,181.86 349.71,189.59 350.93,190.81 351.54,190.81 351.54,198.73 350.11,200.15 350.11,206.86 349.71,207.26 349.71,230.43 353.57,234.29 353.57,235.91 A09.K1
  Bottom 0.203: v316.18,127 314.76,125.58 314.76,121.31 313.13,119.69 C12.D1
!ADD_ACCEPTED  (via drill 0.61)
  Top 0.203: v337.72,45.72 340.56,45.72 D10.E1 | v207.47,68.68 206.25,69.9 121.92,69.9 v121.72,69.7
  Route2 0.203: v337.72,45.72 333.25,41.25 233.48,41.25 229.82,44.91 226.37,44.91 v225.35,45.92
  Route15 0.203: v121.72,69.7 117.04,74.37 117.04,85.75 116.23,86.56 C27.R2
  Bottom 0.203: v225.35,45.92 207.47,63.8 v207.47,68.68
!ADDER_L  (via drill 0.61)
  Top 0.203: v335.28,169.06 335.69,168.66 341.17,168.66 v341.38,168.86 | v381.2,242.01 381.61,241.6 425.3,241.6 425.7,242.01 429.36,242.01 429.77,241.6 434.85,241.6 435.86,242.62 AB02.AH2 | v360.88,177.19 358.65,174.96 346.05,174.96 344.83,173.74 342.39,173.74 341.99,173.33 B10.H1 | v362.92,200.35 363.32,200.76 377.14,200.76 v378.15,201.78
  Route15 0.203: v335.28,169.06 333.25,167.03 333.25,139.8 332.23,138.79 B10.V2 | v360.88,177.19 361.9,178.21 361.9,191.21 363.73,193.04 363.73,199.54 v362.92,200.35
  Bottom 0.203: v341.38,168.86 341.38,172.31 B10.H1 | AB07.AC1 379.78,254.81 381.2,253.39 v381.2,242.01 381,241.6 378.15,238.76 378.15,210.72 378.76,210.11 378.76,202.39 v378.15,201.78
!AND  (via drill 0.61)
  Top 0.203: v315.57,92.46 307.85,92.46 307.04,93.27 C12.N2 | v316.38,105.46 316.79,105.05 327.56,105.05 328.17,105.66 330.61,105.66 331.22,105.05 345.24,105.05 v346.86,106.68 | v346.05,120.7 348.49,120.7 348.69,120.9 360.68,120.9 360.88,120.7 370.03,120.7 371.04,119.69 375.31,119.69 375.51,119.48 C07.D1
  Bottom 0.203: v315.57,92.46 314.76,93.27 314.76,98.75 315.16,99.16 315.16,102.21 314.76,102.62 314.76,103.83 v316.38,105.46 | v346.86,106.68 347.27,107.09 347.27,108.92 C09.H2 347.47,110.34 346.46,111.35 346.46,120.29 v346.05,120.7
!AND_ENABLE  (via drill 0.61)
  Top 0.203: v329.39,239.37 331.22,241.2 350.32,241.2 v350.52,241.4
  Route2 0.203: B08.K1 365.96,167.03 363.93,169.06 363.73,169.06 B08.J1
  Route15 0.203: B08.F1 363.73,176.99 364.74,178 364.74,211.12 362.31,213.56 362.31,227.58 366.57,231.85 367.18,231.85 367.18,233.07 359.05,241.2 350.93,241.2 v350.52,241.4
  Bottom 0.203: B08.K1 366.37,167.44 366.37,172.31 B08.H1 | B08.J1 363.12,170.49 363.12,175.56 B08.F1 | v329.39,239.37 329.79,238.96 329.79,212.95 328.78,211.94 A11.U1 | v350.52,241.4 350.52,245.26 A09.F1
!B  (via drill 0.61)
  Top 0.203: v64.62,84.94 62.59,82.91 31.7,82.91 30.89,83.72 C34.S2 | v75.18,144.07 81.48,150.37 83.52,150.37 AB30.BR1
  Route15 0.203: v64.62,84.94 70.31,90.63 70.31,103.43 73.36,106.48 73.36,109.93 75.59,112.17 75.59,113.18 73.15,115.62 73.15,138.18 72.95,138.38 72.95,141.83 v75.18,144.07
!B_MEM_ENABLE
  Top 0.203: D17.J1 249.53,35.76 251.56,33.73 251.76,33.73 D17.K1 | 250.75,40.84 251.56,40.03 251.76,40.03 D17.H1 | 250.75,40.84 249.53,42.06 D17.F1 | 250.75,40.84 259.69,40.84 261.31,42.47 D16.F1
  Bottom 0.203: D17.A1 251.97,58.12 249.94,56.08 249.94,55.88 D17.B1 251.76,53.03 251.76,52.83 D17.C1 251.97,51.82 251.97,51.61 249.94,49.58 D17.D1 248.92,48.56 248.92,43.48 D17.F1 248.92,42.06 248.92,37.19 D17.J1
!BAC_CLEAR  (via drill 0.61)
  Top 0.203: v27.84,229.41 28.25,229.01 37.19,229.01 37.59,229.41 41.86,229.41 42.27,229.01 46.74,229.01 47.55,229.82 48.56,229.82 A33.M1
  Route15 0.203: v23.57,138.79 24.99,140.21 24.99,195.68 28.25,198.93 28.25,229.01 v27.84,229.41
  Bottom 0.203: v23.57,138.79 23.57,137.16 23.77,136.96 23.77,135.74 22.55,134.52 22.55,95.1 28.25,89.41 28.25,22.96 29.87,21.34 D34.P2
!BADD_ACCEPTED  (via drill 0.61)
  Top 0.203: 31.5,79.65 59.33,79.65 59.74,80.06 64.21,80.06 64.82,79.45 106.07,79.45 106.48,79.05 117.25,79.05 118.26,78.03 C27.U2 | 31.5,79.65 13.82,79.65 9.35,84.12 5.49,84.12 C36.S2 | v27.64,142.85 55.27,142.85 55.27,146.91 B32.S2 | 31.5,79.65 v31.5,81.28
  Bottom 0.203: v27.64,142.85 25.81,141.02 25.81,135.13 26.01,134.93 26.01,126.19 25.81,125.98 25.81,105.26 28.85,102.21 28.85,90.02 31.09,87.78 31.09,84.94 31.5,84.53 v31.5,81.28
!BADDR00  (via drill 0.61)
  Top 0.203: D11.P1 328.37,19.91 328.17,19.91 326.14,17.88 D11.R1 324.71,17.88 323.09,19.51 318.01,19.51 317.19,20.32 317.19,22.15 302.16,22.15 301.75,22.55 296.67,22.55 293.83,25.4 271.68,25.4 268.83,22.55 246.07,22.55 243.64,24.99 209.91,24.99 207.06,22.15 201.98,22.15 195.28,28.85 178,28.85 177.6,29.26 173.94,29.26 173.53,28.85 157.07,28.85 150.57,35.36 134.31,35.36 v132.49,37.19 | v38.81,130.86 38,131.67 27.43,131.67 25.6,133.5 8.13,133.5 8.13,126.19 C36.B1 | v102.21,135.74 101.8,135.33 80.87,135.33 80.47,134.93 40.64,134.93 v40.23,135.33
  Route2 0.203: v40.23,174.14 45.92,179.83 45.92,180.85 58.52,180.85 v59.33,180.03
  Route15 0.203: v132.49,37.19 114.4,55.27 114.4,66.24 115.01,66.85 115.01,73.76 114.4,74.37 114.4,118.67 102.21,130.86 v102.21,135.74
  Bottom 0.203: v38.81,130.86 40.84,132.89 40.84,135.33 | 40.84,135.33 40.84,173.53 v40.23,174.14 | v59.33,180.03 59.94,180.65 59.94,187.35 59.13,188.16 B32.B1 | v40.23,135.33 40.84,135.33
!BADDR01  (via drill 0.61)
  Top 0.203: v51.61,139.6 3.45,139.6 3.45,121.72 4.06,121.11 5.69,121.11 7.32,119.48 C36.D1 | v50.8,165.81 53.03,168.05 v56.49,168.05
  Route2 0.203: D11.R2 318.41,17.88 316.79,19.51 230.02,19.51 223.72,25.81 204.62,25.81 172.92,57.51 130.86,57.51 129.84,58.52 127,58.52 125.98,57.51 35.97,57.51 9.14,84.33 9.14,118.26 8.13,118.26 C36.D1
  Bottom 0.203: D11.R2 319.84,17.68 321.87,19.71 321.87,19.91 D11.P2 | v51.61,139.6 50.8,140.41 v50.8,165.81 | v56.49,168.05 57.51,169.06 57.51,178.61 58.52,179.63 58.52,181.86 B32.D1
!BADDR02  (via drill 0.61)
  Top 0.203: v59.33,121.11 49.99,121.11 46.74,117.86 13.41,117.86 11.79,116.23 C36.E1 | v304.39,11.38 303.99,10.97 301.75,10.97 300.74,9.96 229.21,9.96 228.8,9.55 150.98,9.55 148.13,12.39 v127.61,12.39 | v111.15,118.67 111.15,119.48 110.74,119.48 109.93,120.29 94.28,120.29 93.67,119.69 91.64,119.69 90.22,121.11 86.36,121.11 85.55,121.92 v83.72,121.92
  Route2 0.203: v304.39,11.38 305.41,12.39 317.6,12.39 318.41,11.58 D11.T2 | v83.72,121.92 82.91,121.11 67.67,121.11 66.04,122.73 64.21,122.73 62.59,121.11 v59.33,121.11
  Route15 0.203: v59.33,121.11 59.94,121.72 59.94,170.89 60.76,171.7 60.76,173.94 61.57,174.75 61.57,178.61 B32.E1
  Bottom 0.203: D11.T2 319.43,10.36 321.46,8.33 321.46,8.13 D11.U2 | v127.61,12.39 117.04,12.39 117.04,10.36 116.64,9.96 111.56,9.96 111.56,30.48 114,32.92 114,49.38 111.56,51.82 111.56,115.01 110.34,116.23 110.34,117.86 v111.15,118.67
!BADDR03  (via drill 0.61)
  Top 0.203: v27.03,110.95 12.8,110.95 11.79,109.93 C36.H1 | v31.29,169.27 31.29,171.5 38.81,171.5 39.22,171.91 58.52,171.91 59.33,172.72 61.16,172.72 B32.H1 62.59,172.72 64.21,171.09 122.73,171.09 124.77,169.06 127.41,169.06 128.63,167.84 139.8,167.84 140.61,168.66 174.35,168.66 v176.58,170.89 | v296.06,168.25 296.88,169.06 298.09,169.06 298.5,168.66 306.83,168.66 307.24,169.06 311.71,169.06 312.12,169.47 B12.J1 | v295.86,162.56 295.66,162.36 280.01,162.36 279.81,162.56 276.15,162.56 275.54,161.95 271.68,161.95 v270.66,162.97
  Route2 0.203: v270.66,162.97 268.63,165 245.06,165 242.01,168.05 189.18,168.05 186.13,171.09 176.78,171.09 v176.58,170.89
  Bottom 0.203: v27.03,110.95 28.85,112.78 28.85,133.71 29.26,134.11 29.26,140.41 28.85,140.82 28.85,162.36 31.29,164.79 v31.29,169.27 | v296.06,168.25 295.66,167.84 295.66,162.76 v295.86,162.56
!BADDR04  (via drill 0.61)
  Top 0.203: v303.17,70.31 302.97,70.1 285.7,70.1 285.09,70.71 246.69,70.71 245.26,72.14 120.09,72.14 115.62,76.61 96.52,76.61 94.08,79.05 77.62,79.05 74.78,76.2 55.47,76.2 v54.66,75.39 | v48.16,105.87 48.16,107.49 9.55,107.49 8.74,106.68 C36.J1
  Route2 0.203: v49.99,162.97 55.88,168.86 57.51,168.86 58.12,169.47 B32.J1
  Bottom 0.203: v303.17,70.31 303.17,59.54 D13.A1 | v54.66,75.39 53.65,74.37 53.65,74.17 52.83,73.36 47.95,73.36 47.95,105.66 v48.16,105.87 47.95,106.27 47.95,116.43 48.16,116.64 48.16,117.65 47.95,117.86 47.95,131.06 50.39,133.5 50.39,162.56 v49.99,162.97
!BADDR05  (via drill 0.61)
  Top 0.203: v293.42,2.44 292.2,1.22 105.87,1.22 105.05,2.03 79.86,2.03 79.45,1.63 15.65,1.63 v9.35,7.92 | v45.31,159.51 47.35,161.54 56.49,161.54 58.12,163.17 B32.L1 | v45.31,104.24 45.11,104.44 27.43,104.44 24.18,101.19 9.75,101.19 8.74,100.18 C36.L1
  Route15 0.203: v288.95,7.11 289.36,6.71 289.36,5.89 292,3.25 293.42,3.25 v293.42,2.44 | v45.31,159.51 44.91,159.11 44.91,142.44 v45.72,141.63
  Bottom 0.203: v288.95,7.11 288.95,9.96 295.25,16.26 295.25,36.17 299.31,36.17 D13.J1 | v9.35,7.92 9.14,8.13 9.14,98.55 8.33,99.36 C36.L1 | v45.72,141.63 45.31,141.22 45.31,139.19 44.91,138.79 44.91,104.65 v45.31,104.24
!BADDR06  (via drill 0.61)
  Top 0.203: v245.26,22.15 290.78,22.15 291.39,21.54 295.45,21.54 296.06,20.93 D13.P2 | v241,69.29 239.37,70.92 121.72,70.92 117.25,66.45 85.95,66.45 | 85.95,66.45 18.69,66.45 v17.88,67.26 | v77.42,159.51 77.01,159.11 63.4,159.11 62.59,159.92 B32.M1 | v80.47,114.2 80.67,114 85.55,114 v86.97,112.57 | 85.95,66.45 v85.95,66.24
  Bottom 0.203: v245.26,22.15 241,22.15 v241,69.29 | v17.88,67.26 12.39,72.75 12.39,95.1 11.38,96.11 C36.M1 | v77.42,159.51 79.05,157.89 79.05,117.86 79.65,117.25 79.65,115.01 v80.47,114.2 | v86.97,112.57 88.59,110.95 88.59,89 85.95,86.36 v85.95,66.24
!BADDR07  (via drill 0.61)
  Top 0.203: v105.46,3.66 105.26,3.45 80.87,3.45 78.44,5.89 v25.81,5.89 | v15.04,148.74 16.26,149.96 17.07,149.96 17.48,149.56 40.23,149.56 40.84,150.16 42.88,150.16 43.48,149.56 61.57,149.56 61.57,153.21 B32.P1 | v13.82,96.72 13.82,94.89 11.38,92.46 11.38,91.24 C36.P1
  Bottom 0.203: v105.46,3.66 105.46,1.22 286.92,1.22 294.84,9.14 294.84,11.99 296.47,13.61 D13.S2 | v25.81,5.89 15.85,5.89 15.85,45.92 9.55,52.22 9.55,88.59 10.77,89.81 C36.P1 | v15.04,148.74 15.44,148.34 15.44,98.35 v13.82,96.72
!BADDR08  (via drill 0.61)
  Top 0.203: v295.86,5.08 294.03,3.25 291.8,3.25 290.58,2.03 141.43,2.03 140.61,2.85 125.17,2.85 124.56,2.23 105.46,2.23 105.26,2.44 v79.05,2.44
  Route2 0.203: B32.S1 61.16,147.32 59.54,145.69 20.12,145.69 9.96,135.53 9.96,84.94 10.77,84.94 C36.S1
  Bottom 0.203: v295.86,5.08 295.86,6.71 296.47,7.32 D13.U2 | v79.05,2.44 28.25,2.44 28.25,20.73 18.69,30.28 18.69,65.23 9.96,73.97 9.96,82.7 10.77,83.52 C36.S1
!BADDR09  (via drill 0.61)
  Top 0.203: v3.05,165 3.45,165.41 v9.96,165.41 | v9.96,176.99 8.74,178.21 4.06,178.21 3.45,178.82 3.45,181.46 7.32,181.46 7.52,181.25 16.26,181.25 19.1,184.1 50.39,184.1 51.61,182.88 B32.D2 53.03,182.88 v54.46,182.88
  Bottom 0.203: v3.05,165 3.05,120.7 2.03,119.69 C36.D2 | v9.96,176.99 v9.96,165.41 | v54.46,182.88 54.25,183.08 54.25,189.38 53.85,189.79 53.85,247.29 49.38,247.29 41.66,255.02 41.66,261.52 37.19,261.52 A34.A1
!BADDR10  (via drill 0.61)
  Top 0.203: v5.08,149.35 3.45,149.35 3.45,147.12 4.06,146.51 5.08,146.51 5.08,144.88 3.66,143.46 3.05,143.46 3.05,121.51 3.86,120.7 4.47,120.7 4.47,116.64 C36.E2 | v16.87,151.59 17.27,151.99 30.89,151.99 31.29,151.59 32.31,151.59 32.72,151.99 36.37,151.99 36.78,151.59 38.61,151.59 39.01,151.99 v54.46,151.99 | v54.05,252.58 53.03,253.59 38.81,253.59 37.19,255.22 A34.C1 | v57.71,180.03 57.3,179.63 56.29,179.63 B32.E2
  Route2 0.203: v5.08,149.35 5.28,149.56 14.83,149.56 v16.87,151.59
  Bottom 0.203: v54.46,151.99 54.25,152.2 54.25,177.6 55.27,178.61 B32.E2 | v54.05,252.58 57.1,249.53 57.1,199.14 57.71,198.53 57.71,189.59 57.51,189.38 57.51,180.24 v57.71,180.03
!BADDR11  (via drill 0.61)
  Top 0.203: v4.27,168.45 4.27,171.91 4.06,171.91 3.45,172.52 3.45,174.96 32.51,174.96 v32.92,174.55
  Route2 0.203: v32.92,174.55 35.56,171.91 54.05,171.91 54.86,172.72 B32.H2 | v26.62,249.33 2.85,225.55 2.85,207.26 2.64,207.26 v1.42,206.04
  Bottom 0.203: 3.45,167.64 3.45,166.22 3.86,165.81 3.86,164.59 3.45,164.19 3.45,111.35 4.47,110.34 C36.H2 | 3.45,167.64 v4.27,168.45 | v26.62,249.33 28.25,250.95 28.25,251.97 32.72,251.97 A34.D1 | v1.42,206.04 3.86,203.61 3.86,193.04 3.45,192.63 3.45,167.64
!BBREAK  (via drill 0.61)
  Top 0.203: 54.66,89.2 117.25,89.2 118.26,90.22 C27.P2 | 54.66,89.2 6.5,89.2 5.49,90.22 C36.P2 | 54.66,89.2 v54.66,89
  Bottom 0.203: v54.66,89 54.25,89.41 54.25,97.33 56.69,99.77 56.69,152.4 55.88,153.21 B32.P2
!BDATA00  (via drill 0.61)
  Top 0.203: v40.23,186.54 42.27,188.57 45.31,188.57 B33.B1 | v39.22,243.43 38.61,244.04 35.97,244.04 34.14,245.87 A34.F1
  Route2 0.203: v38.81,132.08 31.9,132.08 27.23,127.41 22.96,127.41 21.34,125.78 C35.B1
  Route15 0.203: v38.81,132.08 38.41,132.49 38.41,184.71 v40.23,186.54
  Bottom 0.203: v39.22,243.43 44.91,237.74 44.91,219.66 45.31,219.25 45.31,215.39 44.91,214.99 44.91,205.84 45.72,205.03 45.72,189.59 B33.B1
!BDATA01  (via drill 0.61)
  Top 0.203: v17.88,181.66 18.29,181.25 44.3,181.25 45.31,182.27 B33.D1 | v43.69,241 39.22,241 39.01,240.79 34.95,240.79 34.14,239.98 A34.J1
  Route2 0.203: v18.29,120.09 19.3,120.09 19.91,119.48 C35.D1
  Bottom 0.203: v18.29,120.09 18.69,120.5 18.69,155.25 16.26,157.68 16.26,180.03 v17.88,181.66 | v43.69,241 47.95,241 47.95,229.41 48.36,229.01 48.36,224.74 47.95,224.33 47.95,178.61 47.14,177.8 45.92,177.8 45.92,181.86 B33.D1
!BDATA02  (via drill 0.61)
  Top 0.203: v47.35,117.25 25.6,117.25 24.59,116.23 C35.E1
  Route2 0.203: v49.17,225.75 46.74,228.19 40.84,228.19 37.59,231.44 35.76,231.44 34.14,233.07 A34.L1
  Bottom 0.203: v47.35,117.25 47.55,117.45 47.55,177.6 48.77,178.82 B33.E1 49.58,180.03 50.39,180.85 50.39,224.54 v49.17,225.75
!BDATA03  (via drill 0.61)
  Top 0.203: v24.38,137.57 24.99,136.96 29.67,136.96 30.07,137.36 32.31,137.36 32.72,136.96 46.74,136.96 v48.36,138.58 | v46.94,225.55 35.36,225.55 34.14,226.77 A34.N1 | v46.74,178.61 v48.36,176.99
  Bottom 0.203: v24.38,137.57 24.38,134.11 24.99,133.5 24.99,111.35 23.98,110.34 C35.H1 | v48.36,138.58 47.95,138.99 47.95,171.3 48.97,172.31 B33.H1 48.77,173.74 48.77,176.58 v48.36,176.99 | v46.94,225.55 47.55,224.94 47.55,179.43 v46.74,178.61
!BDATA04  (via drill 0.61)
  Top 0.203: v21.13,159.51 23.16,161.54 41.05,161.54 v45.31,165.81 | v44.5,218.85 44.09,219.25 35.36,219.25 34.14,220.47 A34.R1
  Bottom 0.203: v21.13,159.51 19.51,157.89 19.51,107.9 20.32,107.09 C35.J1 | v45.31,165.81 45.72,166.22 45.72,169.06 B33.J1 45.52,170.49 44.91,171.09 44.91,189.59 45.11,189.79 45.11,205.03 44.5,205.64 v44.5,218.85
!BDATA05  (via drill 0.61)
  Top 0.203: v44.3,204.62 40.44,204.62 39.22,205.84 35.97,205.84 34.14,207.67 A34.V1
  Route2 0.203: v40.84,110.74 40.44,111.15 36.37,111.15 27.23,102.01 22.96,102.01 21.34,100.38 C35.L1
  Bottom 0.203: v40.84,110.74 44.09,110.74 44.09,155.85 44.5,156.26 44.5,161.54 | 44.5,161.54 45.72,162.76 B33.L1 | v44.3,204.62 44.5,204.42 44.5,161.54
!BDATA06  (via drill 0.61)
  Top 0.203: v44.5,98.35 25.81,98.35 24.59,97.13 C35.M1 | v46.53,159.51 46.94,159.92 48.56,159.92 B33.M1
  Route15 0.203: v41.86,182.07 44.5,179.43 44.5,161.75 46.33,159.92 v46.53,159.51
  Bottom 0.203: v44.5,98.35 44.5,140.21 44.91,140.61 44.91,157.89 v46.53,159.51 | v41.86,182.07 41.66,182.27 41.66,220.07 44.09,222.5 44.09,237.74 39.83,237.74 35.36,242.21 35.36,248.92 30.89,248.92 A34.E2
!BDATA07  (via drill 0.61)
  Top 0.203: v33.53,101.6 26.82,101.6 23.57,98.35 22.55,98.35 22.55,96.32 23.16,95.71 23.57,95.71 23.57,91.24 C35.P1 | v37.19,152.4 37.59,152.81 47.75,152.81 48.56,153.62 B33.P1
  Route15 0.203: v41.86,226.57 40.23,224.94 40.23,221.89 41.66,220.47 41.66,183.49 44.91,180.24 44.91,167.44 47.55,164.79 47.55,155.85 48.77,154.63 B33.P1
  Bottom 0.203: v33.53,101.6 35.36,103.43 35.36,150.57 v37.19,152.4 | v41.86,226.57 41.86,227.18 32.11,236.93 32.11,240.59 30.48,242.21 A34.H2
!BDATA08  (via drill 0.61)
  Top 0.203: v31.9,85.34 25.6,85.34 24.59,84.33 C35.S1 | B33.S1 48.56,147.32 47.75,146.51 32.11,146.51 v31.7,146.91 31.5,146.51 29.46,146.51 v27.64,148.34
  Route15 0.203: v23.37,157.68 22.15,158.9 22.15,192.23 22.96,193.04 22.96,202.59 25.81,205.44 25.81,234.09 26.01,234.29 26.01,236.12 29.46,236.12 A34.K2
  Bottom 0.203: v31.9,85.34 31.7,85.55 v31.7,146.91 | v23.37,157.68 25.81,155.25 25.81,150.16 v27.64,148.34
!BDATA09  (via drill 0.61)
  Top 0.203: v34.95,182.07 35.15,182.27 39.01,182.27 B33.D2
  Route2 0.203: v36.17,130.86 34.75,130.86 24.99,121.11 16.46,121.11 14.83,119.48 C35.D2
  Bottom 0.203: v36.17,130.86 38.41,133.1 38.41,178 40.03,179.63 40.03,181.86 B33.D2 | v34.95,182.07 34.95,214.58 31.29,218.24 31.29,228.6 30.48,229.41 A34.M2
!BDATA10  (via drill 0.61)
  Top 0.203: v39.22,115.01 38.81,114.61 18.9,114.61 18.09,115.42 C35.E2 | v41.05,223.11 38.41,223.11 38,222.71 31.7,222.71 30.89,223.52 A34.P2
  Bottom 0.203: v39.22,115.01 41.25,117.04 41.25,178 42.27,179.02 B33.E2 42.47,180.03 41.05,181.46 v41.05,223.11
!BDATA11  (via drill 0.61)
  Top 0.203: v39.22,110.34 37.19,108.31 18.9,108.31 18.09,109.12 C35.H2 | v31.5,178.41 32.51,177.39 v42.06,177.39
  Bottom 0.203: v39.22,110.34 41.66,112.78 41.66,171.5 42.47,172.31 B33.H2 42.47,173.74 42.47,176.99 v42.06,177.39 | v31.5,178.41 31.5,215.8 30.48,216.81 A34.S2
!BIRQ  (via drill 0.61)
  Route15 0.203: v43.69,156.67 44.5,155.85 44.5,118.87 47.75,115.62 47.75,109.32 48.97,108.1 48.97,105.46 47.95,104.44 47.95,74.17 34.95,61.16 34.95,33.53 32.11,30.68 32.11,29.26 30.48,27.64 D34.M2 | v43.69,194.87 43.48,195.07 43.48,209.91 47.35,213.77 47.35,223.93 44.09,227.18 44.09,235.1 43.28,235.91 A33.K2
  Bottom 0.203: v43.69,156.67 44.09,157.07 44.09,167.44 42.67,168.86 42.67,171.09 44.09,172.52 44.09,194.46 v43.69,194.87
!BMB03  (via drill 0.61)
  Top 0.203: D35.H1 24.59,39.42 25.6,38.41 85.55,38.41 86.56,39.42 D30.H1 | v85.55,32.11 85.95,31.7 97.13,31.7 97.94,30.89 101.19,30.89 101.6,31.29 108.31,31.29 108.92,30.68 D28.L1
  Bottom 0.203: v85.55,32.11 86.16,32.72 86.16,38.2 86.97,39.01 D30.H1
!BMB04
  Top 0.203: D35.L1 21.34,29.87 22.35,28.85 79.65,28.85 80.87,30.07 83.52,30.07 D30.L1
  Route2 0.203: D28.S1 112.37,15.04 112.37,17.88 110.95,17.88 103.83,24.99 91.03,24.99 86.16,29.87 84.94,29.87 D30.L1
!BMB05
  Top 0.203: D35.P1 24.59,20.32 25.4,19.51 85.75,19.51 86.56,20.32 D30.P1
  Route15 0.203: D28.J2 102.82,35.76 101.6,34.54 101.6,31.29 91.24,20.93 87.99,20.93 D30.P1
!BMB06  (via drill 0.61)
  Top 0.203: D35.D2 15.04,48.97 16.05,47.95 76,47.95 77.01,48.97 D30.D2
  Route2 0.203: v81.28,29.26 87.99,22.55 104.04,22.55 105.66,20.93 D28.P2
  Bottom 0.203: v81.28,29.26 79.05,31.5 79.05,47.75 78.23,48.56 D30.D2
!BMB07
  Route2 0.203: D35.H2 18.09,39.22 18.9,38.41 79.25,38.41 80.26,39.42 D30.H2
  Bottom 0.203: D28.V2 102.41,4.47 98.15,4.47 98.15,4.27 97.33,3.45 82.09,3.45 82.09,38.2 81.28,39.01 D30.H2
!BMB08  (via drill 0.61)
  Top 0.203: D35.M2 18.09,27.43 18.9,28.25 79.45,28.25 80.26,27.43 D30.M2 | v124.56,65.02 124.16,64.62 v96.93,64.62
  Route15 0.203: v96.93,64.62 92.46,64.62 92.46,54.86 82.09,44.5 82.09,28.45 81.28,27.64 D30.M2
  Bottom 0.203: v124.56,65.02 124.16,65.43 124.16,109.93 125.37,111.15 125.37,115.21 C27.E1
!BMEM_INCR  (via drill 0.61)
  Top 0.203: v3.86,76.4 2.03,76.4 2.03,80.26 C36.T2 | v10.97,219.25 13.61,221.89 38,221.89 38.81,221.08 39.01,221.08 A33.R2
  Route15 0.203: v8.33,142.85 9.14,143.66 9.14,201.57 10.16,202.59 10.16,210.31 9.96,210.51 9.96,218.24 v10.97,219.25
  Bottom 0.203: v3.86,76.4 3.45,76.81 3.45,99.97 6.1,102.62 6.1,140.61 v8.33,142.85
!BREAK  (via drill 0.61)
  Top 0.203: 127.2,103.23 128.22,104.24 128.22,105.66 C26.J2 | 127.2,103.23 125.58,101.6 117.86,101.6 116.64,100.38 C27.L2 | v339.55,63.4 340.56,62.38 371.65,62.38 v372.67,63.4 | v436.07,66.65 435.25,67.46 392.18,67.46 391.77,67.87 378.15,67.87 377.75,67.46 v373.69,67.46 | v134.52,95.91 127.2,103.23 | v145.49,5.08 147.93,2.64 288.75,2.64 290.58,4.47 v292,4.47
  Route2 0.203: v292,4.47 293.22,3.25 302.97,3.25 303.38,2.85 336.09,2.85 337.51,4.27 D10.V1
  Bottom 0.203: v339.55,63.4 339.55,6.5 338.53,5.49 D10.V1 | v372.67,63.4 372.87,63.6 372.87,67.46 | 372.87,67.46 372.87,77.01 C07.U2 | v436.07,66.65 436.07,61.98 435.25,61.16 435.25,51.82 441.76,45.31 441.76,39.01 444.6,36.17 444.6,32.11 445.82,30.89 D01.L2 | 372.87,67.46 v373.69,67.46 | v134.52,95.91 136.96,93.47 136.96,13.61 v145.49,5.08
!BREAK_OK  (via drill 0.61)
  Top 0.203: v322.68,124.56 323.29,125.17 324.71,125.17 C11.B1 | 316.38,47.55 341.17,47.55 v341.38,47.75 | 316.38,47.55 301.95,47.55 300.74,48.77 D13.D1 | 316.38,47.55 v316.38,47.75
  Route15 0.203: v316.38,47.75 317.19,48.56 317.19,81.48 317.6,81.89 317.6,104.44 318.82,105.66 C11.J2
  Bottom 0.203: v322.68,124.56 321.06,122.94 321.06,112.78 319.63,111.35 319.63,107.29 319.43,107.09 C11.J2 | v341.38,47.75 341.38,51.61 D10.C1
!BRK_RQST  (via drill 0.61)
  Top 0.203: v4.06,15.85 5.08,15.85 14.22,6.71 30.68,6.71 33.12,9.14 88.19,9.14 89.81,10.77 D29.T2 91.24,10.77 92.46,10.77 94.49,8.74 95.5,8.74 95.91,9.14 113.39,9.14 116.64,5.89 137.77,5.89 v140,3.66 | v265.79,151.18 264.16,149.56 212.95,149.56 212.55,149.15 v200.76,149.15
  Route2 0.203: v318.41,147.32 316.59,149.15 309.88,149.15 309.07,149.96 307.85,149.96 307.04,149.15 290.78,149.15 287.73,152.2 266.8,152.2 v265.79,151.18
  Route15 0.203: v318.41,147.32 318.41,145.29 318.62,145.09 B11.T2
  Bottom 0.203: v4.06,15.85 3.05,16.87 3.05,100.99 4.47,102.41 C36.K2 | v200.76,149.15 199.75,148.13 199.75,91.24 197.31,88.8 197.31,62.38 199.95,59.74 199.95,20.73 184.1,4.88 184.1,3.25 183.69,2.85 140,2.85 v140,3.66
!BSKIP  (via drill 0.61)
  Top 0.203: v15.44,241.81 15.65,241.6 38.61,241.6 42.67,245.67 45.31,245.67 A33.F1
  Route15 0.203: v15.44,241.81 15.44,238.96 12.6,236.12 12.6,149.96 15.44,147.12 15.44,83.11 28.25,70.31 28.25,35.76 29.87,34.14 D34.K2
!CARRYOUT0  (via drill 0.61)
  Top 0.203: v346.05,142.04 345.64,142.44 336.5,142.44 335.69,141.63 B10.U2 | v348.29,150.37 349.91,151.99 371.65,151.99 v372.06,151.59 | v317.6,196.29 318.01,195.88 324.92,195.88 325.32,196.29 374.09,196.29 v374.5,196.7
  Route15 0.203: v317.6,196.29 317.4,196.09 317.4,187.76 316.18,186.54 B12.C1
  Bottom 0.203: v346.05,142.04 346.46,142.44 346.46,148.54 v348.29,150.37 | v372.06,151.59 371.86,151.79 371.86,165.2 372.67,166.01 AB07.BK2 373.07,167.44 373.07,169.27 374.29,170.49 374.29,196.49 v374.5,196.7
!CARRYOUT2
  Top 0.203: AB07.BJ1 376.94,169.47 378.56,167.84 384.25,167.84 385.06,167.03 AB06.BK2
!CARRYOUT4
  Top 0.203: AB06.BJ1 389.74,169.67 390.75,168.66 396.04,168.66 397.66,167.03 AB05.BK2
!CARRYOUT6
  Top 0.203: AB05.BJ1 402.34,169.47 403.76,168.05 409.45,168.05 410.46,167.03 AB04.BK2
!CARRYOUT8
  Top 0.203: AB04.BJ1 415.14,169.67 416.97,167.84 422.25,167.84 423.06,167.03 AB03.BK2
!CARRYOUT10
  Top 0.203: AB03.BJ1 427.74,169.47 429.36,167.84 435.05,167.84 435.86,167.03 AB02.BK2
!CLR_PARITY_ERROR  (via drill 0.61)
  Top 0.203: v267.41,195.88 267.82,196.29 v286.51,196.29
  Route15 0.203: v264.77,170.08 267.61,170.08 B15.J2 | v286.51,196.29 285.7,197.1 285.7,209.5 287.73,211.53 287.73,212.34 286.92,213.16 286.11,213.16 286.11,217.63 289.36,220.88 289.36,228.6 290.17,229.41 A14.M1
  Bottom 0.203: v264.77,170.08 263.96,170.89 263.96,182.88 266.6,185.52 266.6,195.07 v267.41,195.88
!CURRENT_ADDR  (via drill 0.61)
  Top 0.203: v441.76,28.85 446.02,33.12 448.46,33.12 D01.K2 | v163.17,99.16 162.76,98.75 153.42,98.75 144.27,107.9 133.71,107.9 132.49,109.12 C26.H2 | v169.47,54.66 170.49,53.65 259.28,53.65 v260.5,52.43 | v262.74,34.34 262.94,34.54 278.38,34.54 284.07,28.85 310.69,28.85 311.51,29.67 312.12,29.67 D12.L1 | v340.36,16.66 340.36,18.69 328.57,18.69 326.14,16.26 315.57,16.26 314.55,17.27 313.54,17.27 D12.R1 | D02.U2 435.86,8.33 435.05,9.14 344.02,9.14 343.2,8.33 341.99,8.33 D10.U1
  Bottom 0.203: v441.76,28.85 441.76,24.18 438.51,20.93 438.51,10.36 436.88,8.74 D02.U2 | D12.R1 312.32,18.09 311.51,18.9 311.51,28.65 312.32,29.46 D12.L1 | v163.17,99.16 168.66,93.67 168.66,55.47 v169.47,54.66 | v260.5,52.43 263.14,49.78 263.14,34.75 v262.74,34.34 | v340.36,16.66 340.16,16.46 340.16,9.55 340.97,8.74 D10.U1
!D_SET  (via drill 0.61)
  Top 0.203: C07.P2 372.26,90.22 371.25,89.2 350.32,89.2 v350.11,89.41 349.91,89.81 349.91,92.25 346.86,92.25 346.25,92.86 345.44,92.86 345.03,92.46 329.59,92.46 v324.92,97.13 | v304.8,172.31 305.21,171.91 v313.54,171.91 | v314.35,136.55 314.76,136.14 v324.51,136.14
  Route15 0.203: v350.11,89.41 349.71,89 349.71,86.77 347.88,84.94 C09.S2
  Bottom 0.203: v304.8,172.31 304.8,185.93 303.58,187.15 303.58,191.41 B13.A1 | v313.54,171.91 314.35,171.09 v314.35,136.55 | v324.51,136.14 324.31,135.94 324.31,120.29 324.92,119.69 C11.D1 325.12,118.26 325.12,117.04 322.88,114.81 322.88,110.74 322.48,110.34 C11.H2 322.68,108.92 323.49,108.1 323.49,102.62 323.09,102.21 323.09,97.94 323.49,97.54 323.49,97.13 v324.92,97.13
!DATA_ADD_EN  (via drill 0.61)
  Top 0.203: v336.3,24.99 326.95,24.99 326.14,24.18 D11.N1 | v336.5,201.78 v346.25,201.78 | v344.22,217.22 346.86,217.22 A09.S2
  Bottom 0.203: A09.T2 344.22,214.99 v344.22,217.22 344.22,219.86 A09.R2 | v336.3,24.99 336.5,25.2 v336.5,201.78 | v346.25,201.78 347.27,202.79 347.27,210.51 A09.U2 347.47,211.94 347.47,216.81 A09.S2
!DATA_ENABLE  (via drill 0.61)
  Top 0.203: A09.P1 353.37,224.33 351.33,226.37 A09.N1 | v331.01,201.57 332.03,202.59 348.29,202.59 v348.69,202.18
  Route15 0.203: v329.79,162.56 v327.76,162.56
  Bottom 0.203: A09.M1 353.77,229.41 353.77,224.54 A09.P1 | v327.76,162.56 326.95,161.75 326.95,97.33 324.31,94.69 324.31,93.07 322.48,91.24 C11.P2 | v329.79,162.56 330.2,162.97 330.2,190.19 331.42,191.41 331.42,201.17 v331.01,201.57 | v348.69,202.18 349.3,202.79 349.3,218.64 350.52,219.86 A09.R1 350.52,221.28 350.52,226.37 A09.N1
!DCA  (via drill 0.61)
  Top 0.203: v306.63,85.34 309.07,82.91 321.26,82.91 321.67,82.5 330.4,82.5 330.81,82.91 342.39,82.91 v344.02,84.53
  Route2 0.203: C07.L1 375.51,99.77 373.89,98.15 349.1,98.15 348.29,97.33 C09.M2
  Route15 0.203: v306.63,85.34 306.63,86.56 C12.R2
  Bottom 0.203: v344.02,84.53 346.46,86.97 346.46,91.44 346.86,91.85 346.86,96.52 C09.M2
!DEFER  (via drill 0.61)
  Top 0.203: v312.93,53.85 315.77,56.69 321.46,56.69 322.48,55.68 323.7,55.68 324.71,56.69 327.56,56.69 329.79,54.46 331.01,54.46 331.22,54.25 338.73,54.25 338.94,54.46 343.81,54.46 344.02,54.25 353.16,54.25 353.37,54.46 356.41,54.46 356.62,54.25 357.83,54.25 v359.46,55.88 | v393.6,42.67 394.61,41.66 421.23,41.66 423.67,44.09 446.84,44.09 448.46,45.72 D01.E2 | v389.94,62.79 387.71,65.02 372.87,65.02 371.25,66.65 v366.57,66.65
  Route15 0.203: v312.93,53.85 312.93,49.99 D12.D1 | v359.46,55.88 366.17,62.59 366.17,77.22 C08.U1
  Bottom 0.203: v393.6,42.67 393.39,42.88 393.39,59.33 v389.94,62.79 | v366.57,66.65 366.57,77.01 C08.U1
!DOUBLE_LEFT_ROTATE  (via drill 0.61)
  Top 0.203: v340.36,251.56 339.95,251.16 326.95,251.16 326.14,251.97 A11.D1
  Bottom 0.203: v340.36,251.56 340.16,251.36 340.16,247.9 342.8,245.26 342.8,151.79 343.81,150.77 B09.R2 344.02,150.16 344.02,145.09 B09.T2 344.83,143.66 344.83,141.22 346.86,141.22 B09.U2 347.27,142.04 347.27,146.91 B09.S2
!DOUBLE_RIGHT_ROTATE  (via drill 0.61)
  Top 0.203: v323.9,229.21 324.51,228.6 338.94,228.6 v340.56,226.97 | v340.56,182.88 343.81,182.88 B09.D2
  Bottom 0.203: 347.07,178.41 347.27,178.61 347.27,178.82 B09.E2 346.86,179.63 344.83,181.66 344.83,181.86 B09.D2 | 347.07,178.41 345.24,176.58 B09.F2 | 347.07,178.41 347.07,173.94 347.27,173.74 B09.H2 | v323.9,229.21 323.9,241 322.68,242.21 A11.H2 | v340.56,226.97 340.16,226.57 340.16,183.29 v340.56,182.88
!E_SET  (via drill 0.61)
  Top 0.203: v358.65,119.89 358.24,120.29 346.86,120.29 346.46,119.89 345.44,119.89 344.83,120.5 330.81,120.5 329.39,121.92 C11.C1 327.96,121.92 327.15,121.11 321.67,121.11 319.84,119.28 C11.D2 318.41,119.48 316.59,119.48 v316.38,119.69 | v304.39,187.55 301.75,187.55 300.74,188.57 B13.B1
  Route2 0.203: v365.15,99.36 364.54,98.75 363.12,98.75 v361.09,100.79 | v356.21,20.93 354.79,19.51 336.09,19.51 332.03,15.44 264.36,15.44 261.93,13.01 245.26,13.01 243.64,11.38 D17.T2
  Route15 0.203: v304.39,187.55 304.8,187.15 304.8,173.53 307.64,170.69 307.64,169.27 307.04,168.66 307.04,164.59 307.85,163.78 307.85,140.41 314.76,133.5 314.76,121.31 v316.38,119.69
  Bottom 0.203: D17.T2 243.23,10.36 245.26,8.33 245.26,8.13 D17.U2 | 368.2,87.38 368.2,92.86 365.15,95.91 v365.15,99.36 | 368.2,87.38 368.2,83.11 369.62,81.69 C07.T2 | v361.09,100.79 361.49,101.19 361.49,117.04 v358.65,119.89 | v356.21,20.93 359.05,23.77 359.05,30.28 361.49,32.72 361.49,64.21 361.09,64.62 361.09,65.43 362.31,66.65 365.56,66.65 365.56,84.73 368.2,87.38
!EA  (via drill 0.61)
  Top 0.203: v263.55,57.91 263.96,57.51 285.9,57.51 v286.51,58.12 | v291.19,86.97 293.01,86.97 C13.R2 | v134.93,59.13 136.55,57.51 189.38,57.51 191.41,59.54 192.43,59.54 194.87,57.1 207.06,57.1 209.91,54.25 262.74,54.25 264.36,52.63 D16.C1
  Route2 0.203: v112.78,174.75 109.73,177.8 72.34,177.8 65.63,184.51 54.05,184.51 51,187.55 35.15,187.55 34.14,188.57 B34.B1
  Route15 0.203: v112.78,174.75 117.86,169.67 117.86,159.31 119.89,157.28 119.89,154.84 120.7,154.03 120.7,128.83 128.22,121.31 128.22,120.5 | 128.22,120.5 128.22,119.69 C26.D2 | v134.93,59.13 123.95,70.1 123.95,110.95 123.75,111.15 123.75,116.03 128.22,120.5
  Bottom 0.203: v263.55,57.91 263.55,54.25 264.77,53.03 D16.C1 | v286.51,58.12 289.56,61.16 289.56,77.01 289.15,77.42 289.15,84.94 v291.19,86.97
!EMA  (via drill 0.61)
  Top 0.203: v242.01,109.93 244.45,107.49 258.06,107.49 260.91,104.65 289.56,104.65 292.4,107.49 343.2,107.49 343.61,107.9 347.68,107.9 348.89,109.12 v351.33,109.12 | v407.42,140.61 409.25,142.44 452.32,142.44 454.36,144.47 454.36,177.8 v455.17,177.8
  Route2 0.203: v242.01,109.93 241.2,110.74 236.73,110.74 217.63,129.84 131.67,129.84 128.22,133.3 19.51,133.3 15.04,137.77 B35.V2 | v351.33,109.12 353.16,110.95 372.67,110.95 379.17,117.45 384.45,117.45 398.27,131.27 398.27,133.91 399.49,133.91 406.2,140.61 v407.42,140.61
  Route15 0.203: v455.17,177.8 454.36,178.61 454.36,193.45 455.57,194.67 455.57,209.5 453.75,211.33 453.75,244.25 452.73,245.26 A01.F1
!ENABLE  (via drill 0.61)
  Top 0.203: v90.02,165.41 82.7,165.41 81.69,166.42 AB30.BK2
  Bottom 0.203: v90.02,165.41 90.42,165.81 90.42,168.05 91.85,169.47 91.85,234.49 93.27,235.91 AB29.AK2
!EXECUTE  (via drill 0.61)
  Top 0.203: v436.68,80.06 437.08,79.65 446.84,79.65 448.46,78.03 C01.U2
  Route2 0.203: v364.74,67.46 369.62,67.46 370.43,66.65 389.74,66.65 390.96,67.87 424.49,67.87 v436.68,80.06
  Bottom 0.203: v364.74,67.46 364.74,73.15 363.93,73.97 C08.V1
!EXT_ADD2  (via drill 0.61)
  Top 0.203: v43.28,87.99 42.67,88.59 17.68,88.59 17.68,84.94 C35.S2
  Route15 0.203: v43.28,87.99 47.35,92.05 47.35,109.53 44.09,112.78 44.09,146.1 43.28,146.91 B33.S2
!F_SET  (via drill 0.61)